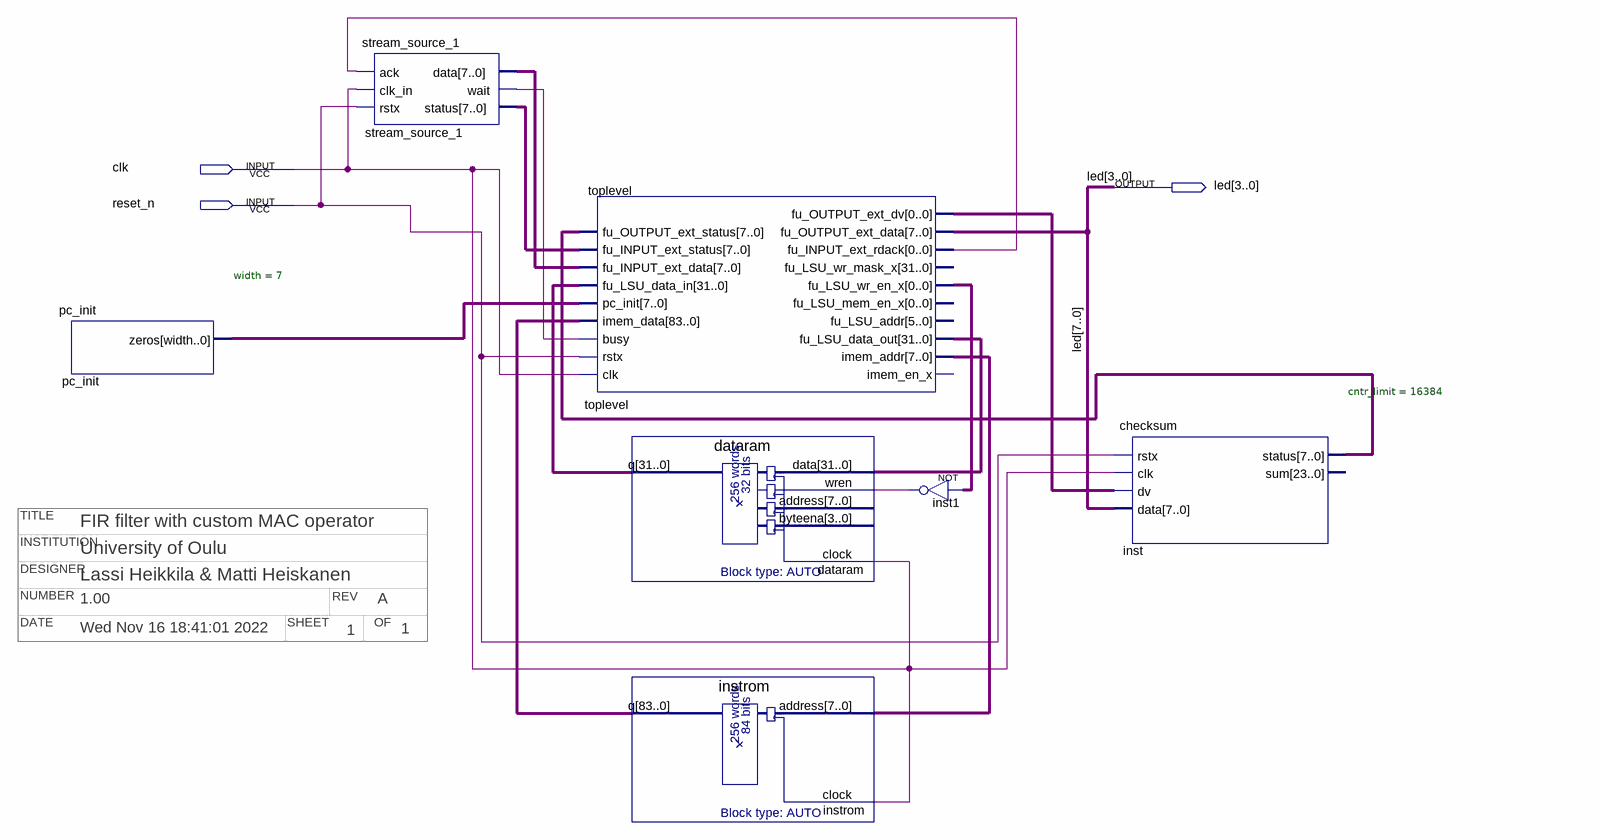
[diagram p0: schematic sheet]
// Quartus schematic mac.bdf as structural Verilog: 7 symbols, 3 pins
// Title block: DATE: Wed Nov 16 18:41:01 2022; DESIGNER: Lassi Heikkila & Matti Heiskanen; INSTITUTION: University of Oulu; NUMBER: 1.00; OF: 1; REV: A; SHEET: 1; TITLE: FIR filter with custom MAC operator
module mac (
  input  clk,
  input  reset_n,
  output [7:0] led
);

  wire inst1_out, stream_source_1_wait, toplevel_fu_input_ext_rdack, toplevel_fu_lsu_wr_en_x,
       toplevel_fu_output_ext_dv;
  wire [7:0] inst_status, pc_init_zeros, stream_source_1_data, stream_source_1_status, toplevel_imem_addr;
  wire [31:0] dataram_q, toplevel_fu_lsu_data_out;
  wire [83:0] instrom_q;

  pc_init #(.width(7)) pc_init (.zeros(pc_init_zeros));
  stream_source_1 stream_source_1 (
    .ack(toplevel_fu_input_ext_rdack), .clk_in(clk), .rstx(reset_n), .data(stream_source_1_data),
    .\wait (stream_source_1_wait), .status(stream_source_1_status));
  toplevel toplevel (
    .clk(clk), .rstx(reset_n), .busy(stream_source_1_wait), .imem_data(instrom_q), .pc_init(pc_init_zeros),
    .fu_LSU_data_in(dataram_q), .fu_INPUT_ext_data(stream_source_1_data),
    .fu_INPUT_ext_status(stream_source_1_status), .fu_OUTPUT_ext_status(inst_status),
    .imem_addr(toplevel_imem_addr), .fu_LSU_data_out(toplevel_fu_lsu_data_out),
    .fu_LSU_wr_en_x(toplevel_fu_lsu_wr_en_x), .fu_INPUT_ext_rdack(toplevel_fu_input_ext_rdack),
    .fu_OUTPUT_ext_data(led), .fu_OUTPUT_ext_dv(toplevel_fu_output_ext_dv));  // open: imem_en_x, fu_LSU_addr, fu_LSU_mem_en_x, fu_LSU_wr_mask_x
  dataram dataram (
    .data(toplevel_fu_lsu_data_out), .wren(inst1_out), .clock(clk), .q(dataram_q));  // open: address, byteena
  instrom instrom (.address(toplevel_imem_addr), .clock(clk), .q(instrom_q));
  not inst1 (inst1_out, toplevel_fu_lsu_wr_en_x);
  checksum #(.cntr_limit(16384)) inst (
    .rstx(reset_n), .clk(clk), .dv(toplevel_fu_output_ext_dv), .data(led), .status(inst_status));  // open: sum
endmodule
